# EAGLE schematic ece411-t4-tx-hand-controlled-robot (EAGLE 8.4.0)
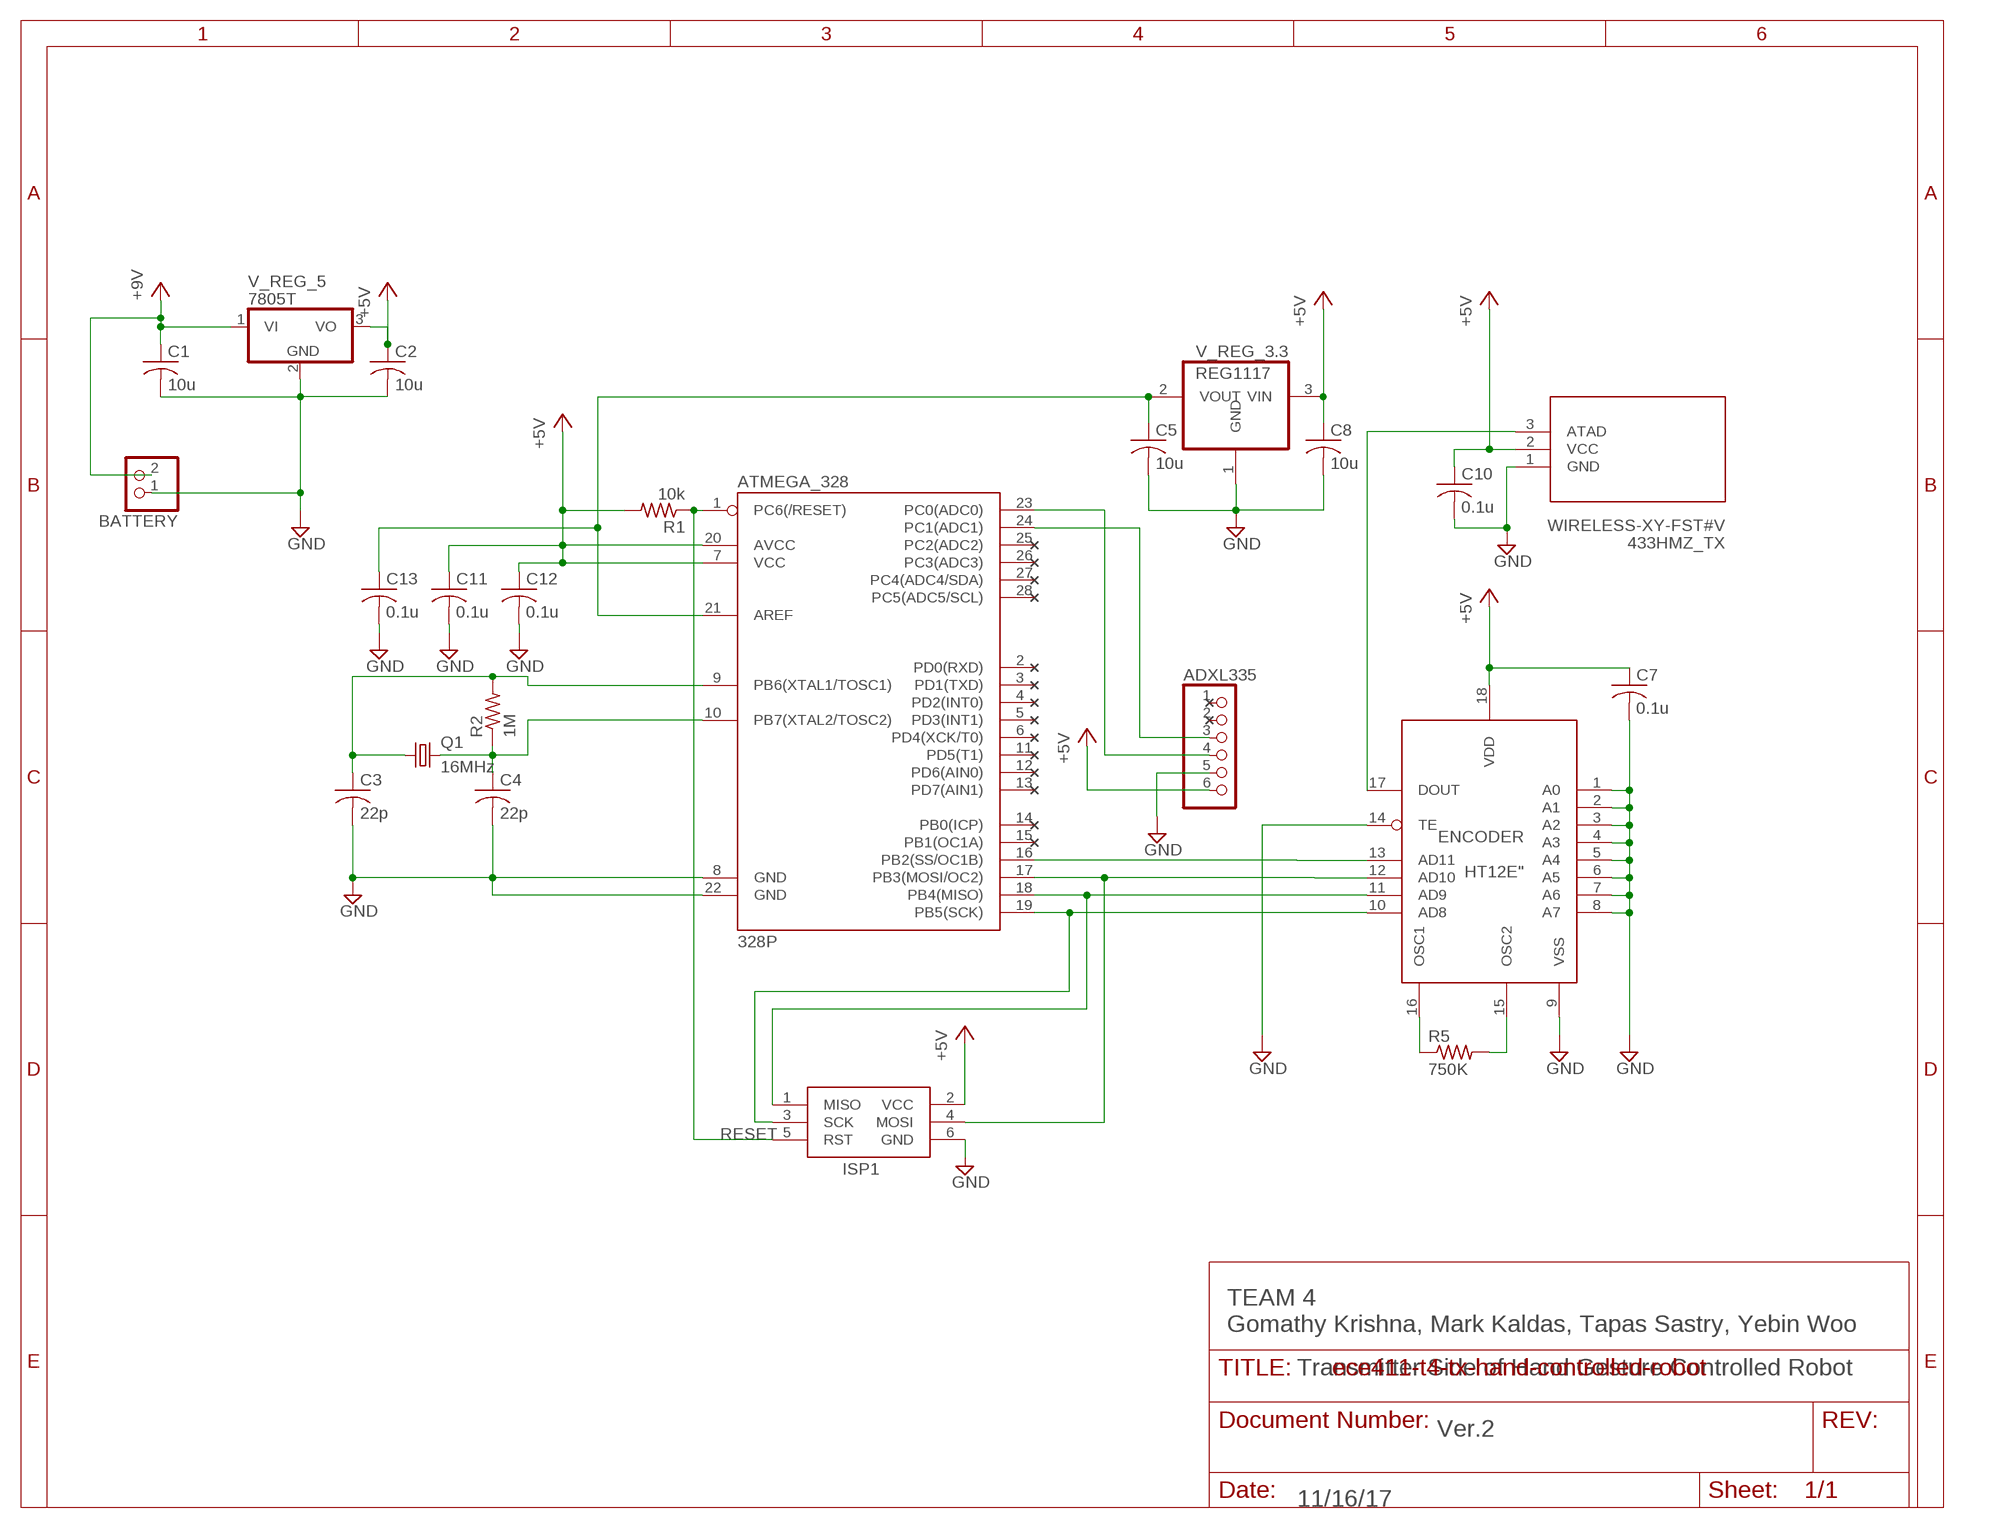
[diagram p0: schematic, sheet 1]

## Parts
433HMZ_TX  WIRELESS-XY-FST#V  [WIRELESS-XY-FST#V]
ADXL335  PINHD-1X6  [1X06]
ATMEGA_328  328P  ATMEGA328P_PDIP  [DIP28]
BATTERY  PINHD-1X2  [1X02]
C1  10u  C-USC0805  [C0805]
C2  10u  C-USC0805  [C0805]
C3  22p  C-USC0805  [C0805]
C4  22p  C-USC0805  [C0805]
C5  10u  C-USC0805  [C0805]
C7  0.1u  C-USC0805  [C0805]
C8  10u  C-USC0805  [C0805]
C10  0.1u  C-USC0805  [C0805]
C11  0.1u  C-USC0805  [C0805]
C12  0.1u  C-USC0805  [C0805]
C13  0.1u  C-USC0805  [C0805]
ENCODER  HT12E"  [18-DIP-A]
ISP1  AVRISP-6  [AVRISP]
Q1  16MHz  CRYTALHC49S  [HC49/S]
R1  10k  R-US_R0805  [R0805]
R2  1M  R-US_R0805  [R0805]
R5  750K  R-US_R0805  [R0805]
V_REG_3.3  REG1117  [SOT223]
V_REG_5  7805T  [TO220H]

## Nets
+5V [Supply]: 433HMZ_TX.2(VCC) ADXL335.6 ATMEGA_328.7(VCC) ATMEGA_328.20(AVCC) C2.1 C7.1 C8.1 C10.1 C11.1 C12.1 ENCODER.18(VDD) ISP1.2(VCC) R1.2 V_REG_3.3.3(VIN) V_REG_5.3(VO)
AD08: ATMEGA_328.19(PB5(SCK)) ENCODER.10(AD8) ISP1.3(SCK)
GND: 433HMZ_TX.1(GND) ADXL335.5 ATMEGA_328.8(GND) ATMEGA_328.22(GND) BATTERY.1 C1.2 C2.2 C3.2 C4.2 C5.2 C7.2 C8.2 C10.2 C11.2 C12.2 C13.2 ENCODER.1(A0) ENCODER.2(A1) ENCODER.3(A2) ENCODER.4(A3) ENCODER.5(A4) ENCODER.6(A5) ENCODER.7(A6) ENCODER.8(A7) ENCODER.9(VSS) ENCODER.14(TE) ISP1.6(GND) V_REG_3.3.1(GND) V_REG_5.2(GND)
N$1: ATMEGA_328.9(PB6(XTAL1/TOSC1)) C3.1 Q1.1 R2.2
N$2: ATMEGA_328.18(PB4(MISO)) ENCODER.11(AD9) ISP1.1(MISO)
N$3: ADXL335.4 ATMEGA_328.23(PC0(ADC0))
N$4: ATMEGA_328.10(PB7(XTAL2/TOSC2)) C4.1 Q1.2 R2.1
N$5: ENCODER.16(OSC1) R5.1
N$6: ENCODER.15(OSC2) R5.2
N$7: 433HMZ_TX.3(ATAD) ENCODER.17(DOUT)
N$8: ATMEGA_328.16(PB2(SS/OC1B)) ENCODER.13(AD11)
N$9: ATMEGA_328.17(PB3(MOSI/OC2)) ENCODER.12(AD10) ISP1.4(MOSI)
N$11: ADXL335.3 ATMEGA_328.24(PC1(ADC1))
N$19: ATMEGA_328.21(AREF) C5.1 C13.1 V_REG_3.3.2(VOUT)
RESET: ATMEGA_328.1(PC6(/RESET)) ISP1.5(RST) R1.1
VCC [Supply]: BATTERY.2 C1.1 V_REG_5.1(VI) ; supply symbol labelled +9V
Unconnected: ADXL335.1 ADXL335.2 ATMEGA_328.2(PD0(RXD)) ATMEGA_328.3(PD1(TXD)) ATMEGA_328.4(PD2(INT0)) ATMEGA_328.5(PD3(INT1)) ATMEGA_328.6(PD4(XCK/T0)) ATMEGA_328.11(PD5(T1)) ATMEGA_328.12(PD6(AIN0)) ATMEGA_328.13(PD7(AIN1)) ATMEGA_328.14(PB0(ICP)) ATMEGA_328.15(PB1(OC1A)) ATMEGA_328.25(PC2(ADC2)) ATMEGA_328.26(PC3(ADC3)) ATMEGA_328.27(PC4(ADC4/SDA)) ATMEGA_328.28(PC5(ADC5/SCL))

## Notes on the sheet
- TEAM 4
  Gomathy Krishna, Mark Kaldas, Tapas Sastry, Yebin Woo
- Transmitter Side of Hand Gesture Controlled Robot
- Ver.2
- 11/16/17

## Library data of the parts
433HMZ_TX = diy-modules:WIRELESS-XY-FST#V: RF Wireless XY-FST Transmitter vertically mounted Click here to find device on ebay.com <http://www.ebay.com/sch/xd+fst+transmitter> Note: Sold together with receiver.
ADXL335 = adafruit:PINHD-1X6: PIN HEADER
ATMEGA_328 = SparkFun-IC-Microcontroller:ATMEGA328P_PDIP: Atmel 328P Through hole ATMEGA328P uC used in the Arduino 32kb flash, 1k EEPROM, 2k SRAM Datasheet <http://www.sparkfun.com/datasheets/Components/SMD/ATMega328.pdf> SparkFun Products Storefront component: AVR 28 Pin 20MHz 32K 6A/D - ATMega328P <https://www.sparkfun.com/products/9061> (COM-09061) SparkFun Simon Says - Through-Hole Soldering Kit <https://www.sparkfun.com/products/10547> (KIT-10547) SparkFun Learn to Solder - Simon Says <https://www.sparkfun.com/products/13708> (KIT-13708) SparkFun BigTime Watch Kit <https://www.sparkfun.com/products/11734> (KIT-11734) SparkFun ClockIt <https://www.sparkfun.com/products/10930> (KIT-10930) SparkFun Serial Enabled LCD Kit <https://www.sparkfun.com/products/10097> (LCD-10097) SparkFun Simon Tilts - Through Hole Soldering Kit <https://www.sparkfun.com/products/12634> (KIT-12634) SparkFun Frequency Counter Kit <https://www.sparkfun.com/products/10140> (KIT-10140) FabFM Radio Kit <https://www.sparkfun.com/products/11043> (KIT-11043) SparkFun Binary Blaster Kit <https://www.sparkfun.com/products/12037> (KIT-12037) SparkFun Metro-Gnome <https://www.sparkfun.com/products/9236> (KIT-09236) ATmega328 with Arduino Optiboot (Uno) <https://www.sparkfun.com/products/10524> (DEV-10524); PROD_ID: IC-09136
BATTERY = pinhead:PINHD-1X2: PIN HEADER
C1-C5 C7 C8 C10-C13 = adafruit:C-US: CAPACITOR, American symbol
ENCODER = holtek:HT12E: transmitter = encoder ic
ISP1 = adafruit:AVRISP: AVR ISP HEADER Standard 6 pin header for AVR programming
Q1 = crystal:CRYTAL: CRYSTAL
R1 R2 R5 = adafruit:R-US_: RESISTOR, American symbol
V_REG_3.3 = burr-brown:REG1117: 800mA and 1A Low Dropout (LDO) Positive Regulator 1.8V, 2.5V, 2.85V, 3.3V, 5V, and Adj; MPN: REG1117; OC_FARNELL: 1097566; OC_NEWARK: 14P6981
V_REG_5 = linear:78*: Positive VOLTAGE REGULATOR Source: http://cache.national.com/ds/LM/LM78L05.pdf http://www.fairchildsemi.com/ds/LM/LM7805.pdf

## Net classes
0 default: width 0.178 mm, drill 0.406 mm, clearance 0.203 mm
1 Supply: width 1.27 mm, drill 0.406 mm, clearance 0.203 mm to class 0, clearance 0.203 mm